# EAGLE design balise émettrice analogique (EAGLE 6.3)
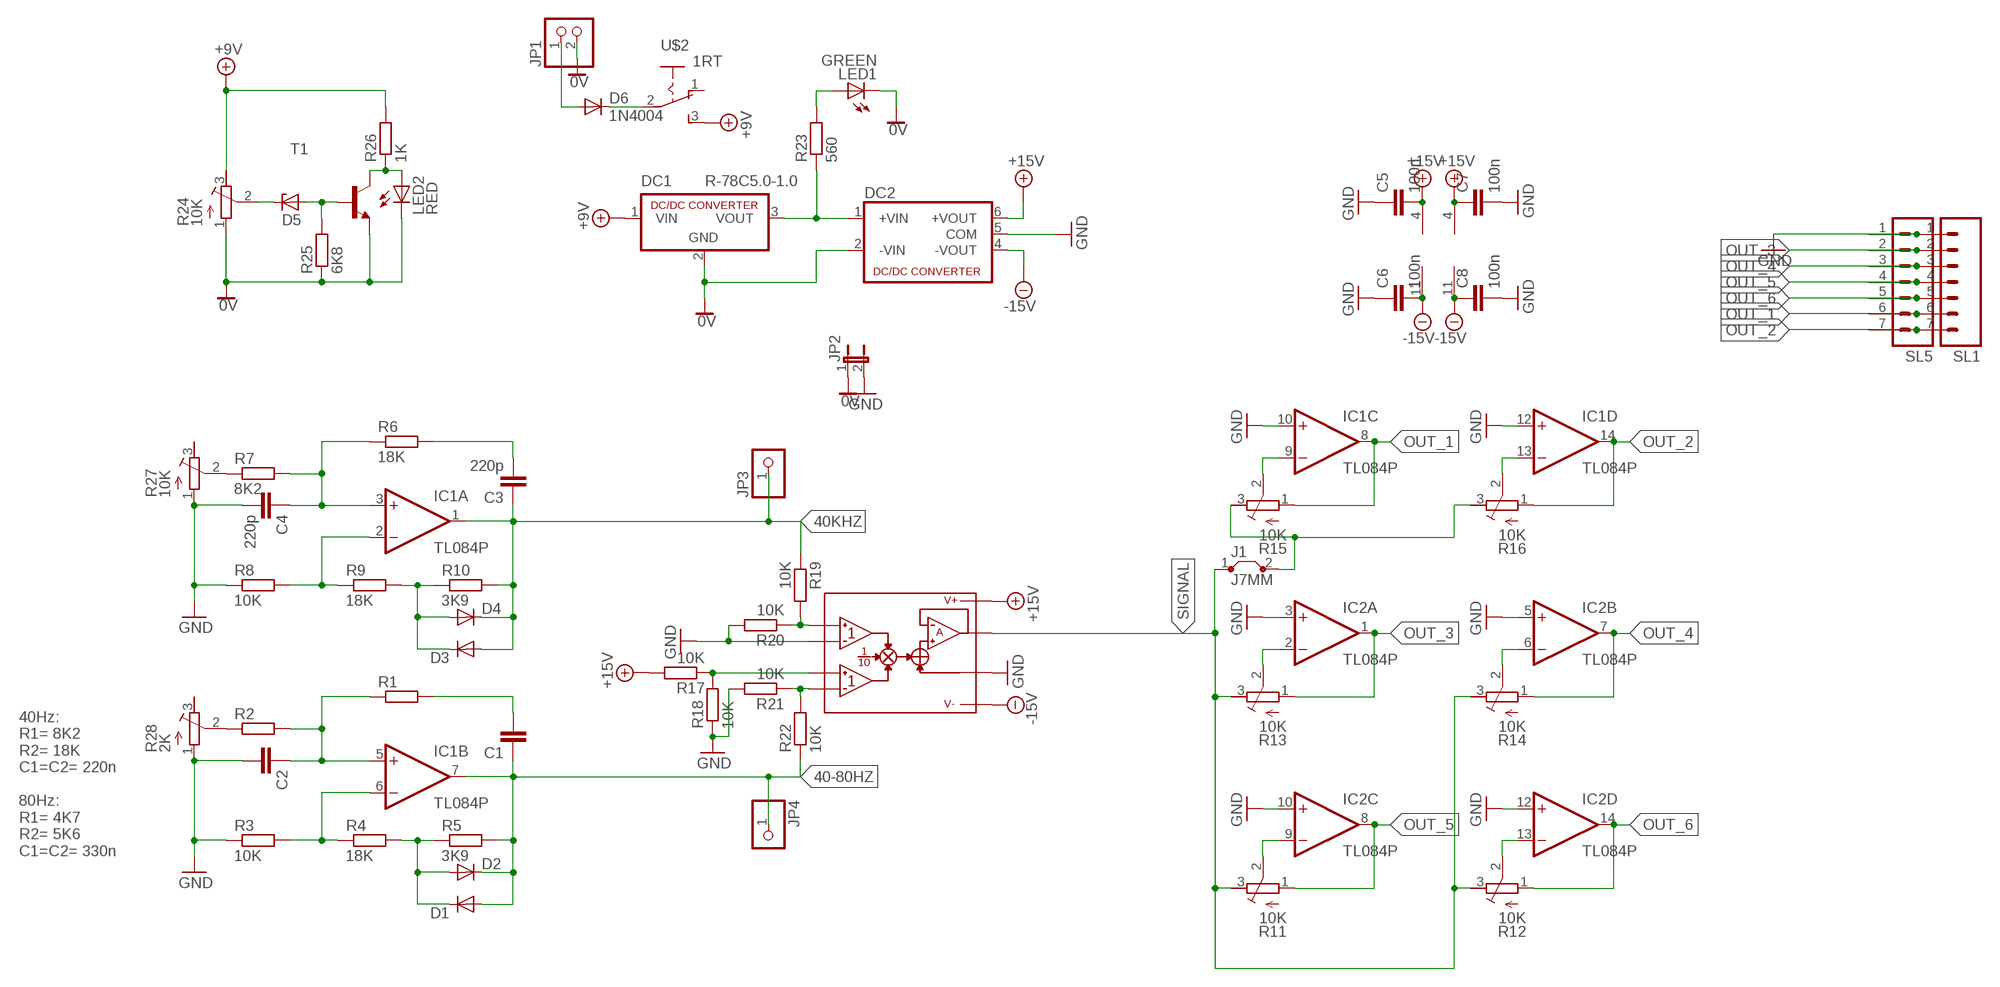
[diagram p0: schematic, sheet 1]

## Parts
C1  C-EU075-032X103  [C075-032X103]
C2  C-EU075-032X103  [C075-032X103]
C3  220p  C-EU075-032X103  [C075-032X103]
C4  220p  C-EU075-032X103  [C075-032X103]
C5  100n  C-EU050-024X044  [C050-024X044]
C6  100n  C-EU050-024X044  [C050-024X044]
C7  100n  C-EU050-024X044  [C050-024X044]
C8  100n  C-EU050-024X044  [C050-024X044]
D1  DIODE-D-2.5  [D-2.5]
D2  DIODE-D-2.5  [D-2.5]
D3  DIODE-D-2.5  [D-2.5]
D4  DIODE-D-2.5  [D-2.5]
D5  ZENER-DIODEZD-2.5  [ZDIO-2.5]
D6  1N4004  [DO41-10]
DC1  R-78C5.0-1.0  [SIP3]
DC2  NMA  [NMA]
IC1  TL084P  [DIL14]
IC2  TL084P  [DIL14]
J1  J7MM  [07]
JP1  PINHD-1X2  [1X02]
JP2  JP1E  [JP1]
JP3  PINHD-1X1  [1X01]
JP4  PINHD-1X1  [1X01]
LED1  GREEN  LEDB155  [Q62902-B155]
LED2  RED  LEDB155  [Q62902-B155]
R1  R-EU_0207/2V  [0207/2V]
R2  R-EU_0204/7  [0204/7]
R3  10K  R-EU_0207/2V  [0207/2V]
R4  18K  R-EU_0207/2V  [0207/2V]
R5  3K9  R-EU_0207/2V  [0207/2V]
R6  18K  R-EU_0207/2V  [0207/2V]
R7  8K2  R-EU_0207/2V  [0207/2V]
R8  10K  R-EU_0207/2V  [0207/2V]
R9  18K  R-EU_0207/2V  [0207/2V]
R10  3K9  R-EU_0207/2V  [0207/2V]
R11  10K  R-TRIMM3339P  [RTRIM3339P]
R12  10K  R-TRIMM3339P  [RTRIM3339P]
R13  10K  R-TRIMM3339P  [RTRIM3339P]
R14  10K  R-TRIMM3339P  [RTRIM3339P]
R15  10K  R-TRIMM3339P  [RTRIM3339P]
R16  10K  R-TRIMM3339P  [RTRIM3339P]
R17  10K  R-EU_0207/2V  [0207/2V]
R18  10K  R-EU_0207/2V  [0207/2V]
R19  10K  R-EU_0207/2V  [0207/2V]
R20  10K  R-EU_0207/2V  [0207/2V]
R21  10K  R-EU_0207/2V  [0207/2V]
R22  10K  R-EU_0207/2V  [0207/2V]
R23  560  R-EU_0204/7  [0204/7]
R24  10K  R-TRIMM3339P  [RTRIM3339P]
R25  6K8  R-EU_0207/2V  [0207/2V]
R26  1K  R-EU_0207/2V  [0207/2V]
R27  10K  R-TRIMM3339P  [RTRIM3339P]
R28  2K  R-TRIMM3339P  [RTRIM3339P]
SL1  M07  [07P]
SL5  M07  [07P]
T1  2N5400-NPN-TO92-CBE  [TO92-CBE]
U$1  AD633JN  [DIL08]
U$2  1RT  [1RT]

## Nets
0V: DC1.2(GND) DC2.2(-VIN) JP1.2 JP2.1 LED1.K(C) LED2.K(C) R24.1(E) R25.1 T1.E
40-80HZ: C1.1 D1.A D2.C IC1.7(B:OUT) JP4.1 R5.2 R22.1
40KHZ: C3.1 D3.A D4.C IC1.1(A:OUT) JP3.1 R10.2 R19.1
+9V: DC1.1(VIN) R24.3(A) R26.2 U$2.3(S)
+15V: C5.2 C7.1 DC2.6(+VOUT) IC1.4(P:V+) IC2.4(P:V+) R17.2 U$1.8(+V)
-15V: C6.2 C8.1 DC2.4(-VOUT) IC1.11(P:V-) IC2.11(P:V-) U$1.5(-V)
GND: C2.2 C4.2 C5.1 C6.1 C7.2 C8.2 DC2.5(COM) IC1.10(C:+IN) IC1.12(D:+IN) IC2.3(A:+IN) IC2.5(B:+IN) IC2.10(C:+IN) IC2.12(D:+IN) JP2.2 R3.1 R8.1 R18.1 R20.2 R21.2 R27.1(E) R28.1(E) SL1.1 SL5.1 U$1.2(X2) U$1.6(Z)
N$1: IC1.6(B:-IN) R3.2 R4.1
N$2: D1.C D2.A R4.2 R5.1
N$3: IC2.9(C:-IN) R11.2(S)
N$4: C1.2 R1.2
N$5: C2.1 IC1.5(B:+IN) R1.1 R2.2
N$6: IC1.2(A:-IN) R8.2 R9.1
N$7: D3.C D4.A R9.2 R10.1
N$8: R17.1 R18.2 U$1.3(Y1)
N$9: C3.2 R6.2
N$10: C4.1 IC1.3(A:+IN) R6.1 R7.2
N$11: DC1.3(VOUT) DC2.1(+VIN) R23.1
N$12: IC2.13(D:-IN) R12.2(S)
N$13: R19.2 R20.1 U$1.1(X1)
N$14: LED1.A R23.2
N$15: IC2.2(A:-IN) R13.2(S)
N$16: R21.1 R22.2 U$1.4(Y2)
N$17: D5.C R24.2(S)
N$18: IC2.6(B:-IN) R14.2(S)
N$19: D5.A R25.2 T1.B
N$20: D6.A JP1.1
N$21: IC1.9(C:-IN) R15.2(S)
N$22: LED2.A R26.1 T1.C
N$23: D6.C U$2.2(P)
N$24: IC1.13(D:-IN) R16.2(S)
N$25: J1.2 R15.3(A) R16.3(A)
N$26: R7.1 R27.2(S)
N$27: R2.1 R28.2(S)
OUT_1: IC1.8(C:OUT) R15.1(E) SL1.6 SL5.6
OUT_2: IC1.14(D:OUT) R16.1(E) SL1.7 SL5.7
OUT_3: IC2.1(A:OUT) R13.1(E) SL1.2 SL5.2
OUT_4: IC2.7(B:OUT) R14.1(E) SL1.3 SL5.3
OUT_5: IC2.8(C:OUT) R11.1(E) SL1.4 SL5.4
OUT_6: IC2.14(D:OUT) R12.1(E) SL1.5 SL5.5
SIGNAL: J1.1 R11.3(A) R12.3(A) R13.3(A) R14.3(A) U$1.7(W)
Unconnected: R27.3(A) R28.3(A) U$2.1(O)

## Notes on the sheet
- 40Hz:
  R1= 8K2
  R2= 18K
  C1=C2= 220n
  
  80Hz:
  R1= 4K7
  R2= 5K6
  C1=C2= 330n

## Library data of the parts
C1 C2 C5-C8 = resistor:C-EU: CAPACITOR, European symbol; OC_FARNELL: unknown
C3 C4 = resistor:C-EU: CAPACITOR, European symbol; MF: PANASONIC ELECTRONIC COMPONENTS; MPN: EEE1EA220SP; OC_FARNELL: 9696970
D1-D4 = diode:DIODE-: DIODE; OC_FARNELL: unknown
D5 = diode:ZENER-DIODE: Z-Diode; OC_FARNELL: unknown
D6 = diode:1N4004: DIODE general purpose rectifier, 1 A; OC_FARNELL: unknown
DC1 = dc-dc-converter:R-78C*-1.0: INNOLINE DC/DC-Converter 1.0 AMP SIP3 Single Output Source: Data sheet <http://www.mikrocontroller.net/attachment/150645/157764-da-01-en-DC_DC_WANDLER_R_78C5_0_1_0.pdf>; OC_FARNELL: unknown
DC2 = dc-dc-converter:NMA: DC-DC CONVERTER; MF: MURATA POWER SOLUTIONS; MPN: NMA1205DC; OC_FARNELL: 1021434; OC_NEWARK: 61K3064
IC1 IC2 = linear:TL084: OP AMP; OC_FARNELL: unknown
J1 = jumper:J: Bridge; OC_FARNELL: unknown
JP1 = pinhead:PINHD-1X2: PIN HEADER; OC_FARNELL: unknown
JP2 = jumper:JP1E: JUMPER; OC_FARNELL: unknown
JP3 JP4 = pinhead:PINHD-1X1: PIN HEADER; OC_FARNELL: unknown
LED1 LED2 = led:LED: LED OSRAM: - CHIPLED LG R971, LG N971, LY N971, LG Q971, LY Q971, LO R971, LY R971 LH N974, LH R974 LS Q976, LO Q976, LY Q976 LO Q996 - Hyper CHIPLED LW Q18S LB Q993, LB Q99A, LB R99A - SideLED LS A670, LO A670, LY A670, LG A670, LP A670 LB A673, LV A673, LT A673, LW A673 LH A674 LY A675 LS A676, LA A676, LO A676, LY A676, LW A676 LS A679, LY A679, LG A679 - Hyper Micro SIDELED® LS Y876, LA Y876, LO Y876, LY Y876 LT Y87S - SmartLED LW L88C, LW L88S LB L89C, LB L89S, LG L890 LS L89K, LO L89K, LY L89K LS L896, LA L896, LO L896, LY L896 - TOPLED LS T670, LO T670, LY T670, LG T670, LP T670 LSG T670, LSP T670, LSY T670, LOP T670, LYG T670 LG T671, LOG T671, LSG T671 LB T673, LV T673, LT T673, LW T673 LH T674 LS T676, LA T676, LO T676, LY T676, LB T676, LH T676, LSB T676, LW T676 LB T67C, LV T67C, LT T67C, LS T67K, LO T67K, LY T67K, LW E67C LS E67B, LA E67B, LO E67B, LY E67B, LB E67C, LV E67C, LT E67C LW T67C LS T679, LY T679, LG T679 LS T770, LO T770, LY T770, LG T770, LP T770 LB T773, LV T773, LT T773, LW T773 LH T774 LS E675, LA E675, LY E675, LS T675 LS T776, LA T776, LO T776, LY T776, LB T776 LHGB T686 LT T68C, LB T68C - Hyper Mini TOPLED® LB M676 - Mini TOPLED Santana® LG M470 LS M47K, LO M47K, LY M47K Source: http://www.osram.convergy.de LUXEON: - LUMILED® LXK2-PW12-R00, LXK2-PW12-S00, LXK2-PW14-U00, LXK2-PW14-V00 LXK2-PM12-R00, LXK2-PM12-S00, LXK2-PM14-U00 LXK2-PE12-Q00, LXK2-PE12-R00, LXK2-PE12-S00, LXK2-PE14-T00, LXK2-PE14-U00 LXK2-PB12-K00, LXK2-PB12-L00, LXK2-PB12-M00, LXK2-PB14-N00, LXK2-PB14-P00, LXK2-PB14-Q00 LXK2-PR12-L00, LXK2-PR12-M00, LXK2-PR14-Q00, LXK2-PR14-R00 LXK2-PD12-Q00, LXK2-PD12-R00, LXK2-PD12-S00 LXK2-PH12-R00, LXK2-PH12-S00 LXK2-PL12-P00, LXK2-PL12-Q00, LXK2-PL12-R00 Source: www.luxeon.com KINGBRIGHT: KA-3528ASYC Source: www.kingbright.com; OC_FARNELL: unknown
R1-R10 R17-R23 R25 R26 = resistor:R-EU_: RESISTOR, European symbol; OC_FARNELL: unknown
R11-R16 R24 R27 R28 = resistor:R-TRIMM: Trimm resistor; OC_FARNELL: unknown
SL1 SL5 = con-amp-quick:M07: AMP QUICK CONNECTOR; OC_FARNELL: unknown; OC_NEWARK: unknown
T1 = transistor:*-NPN-: NPN Transistror BF959 corrected 2008.03.06; OC_FARNELL: unknown
U$1 = analog-devices:AD633JN; OC_FARNELL: unknown
U$2 = switch:1RT; OC_FARNELL: unknown

## Board
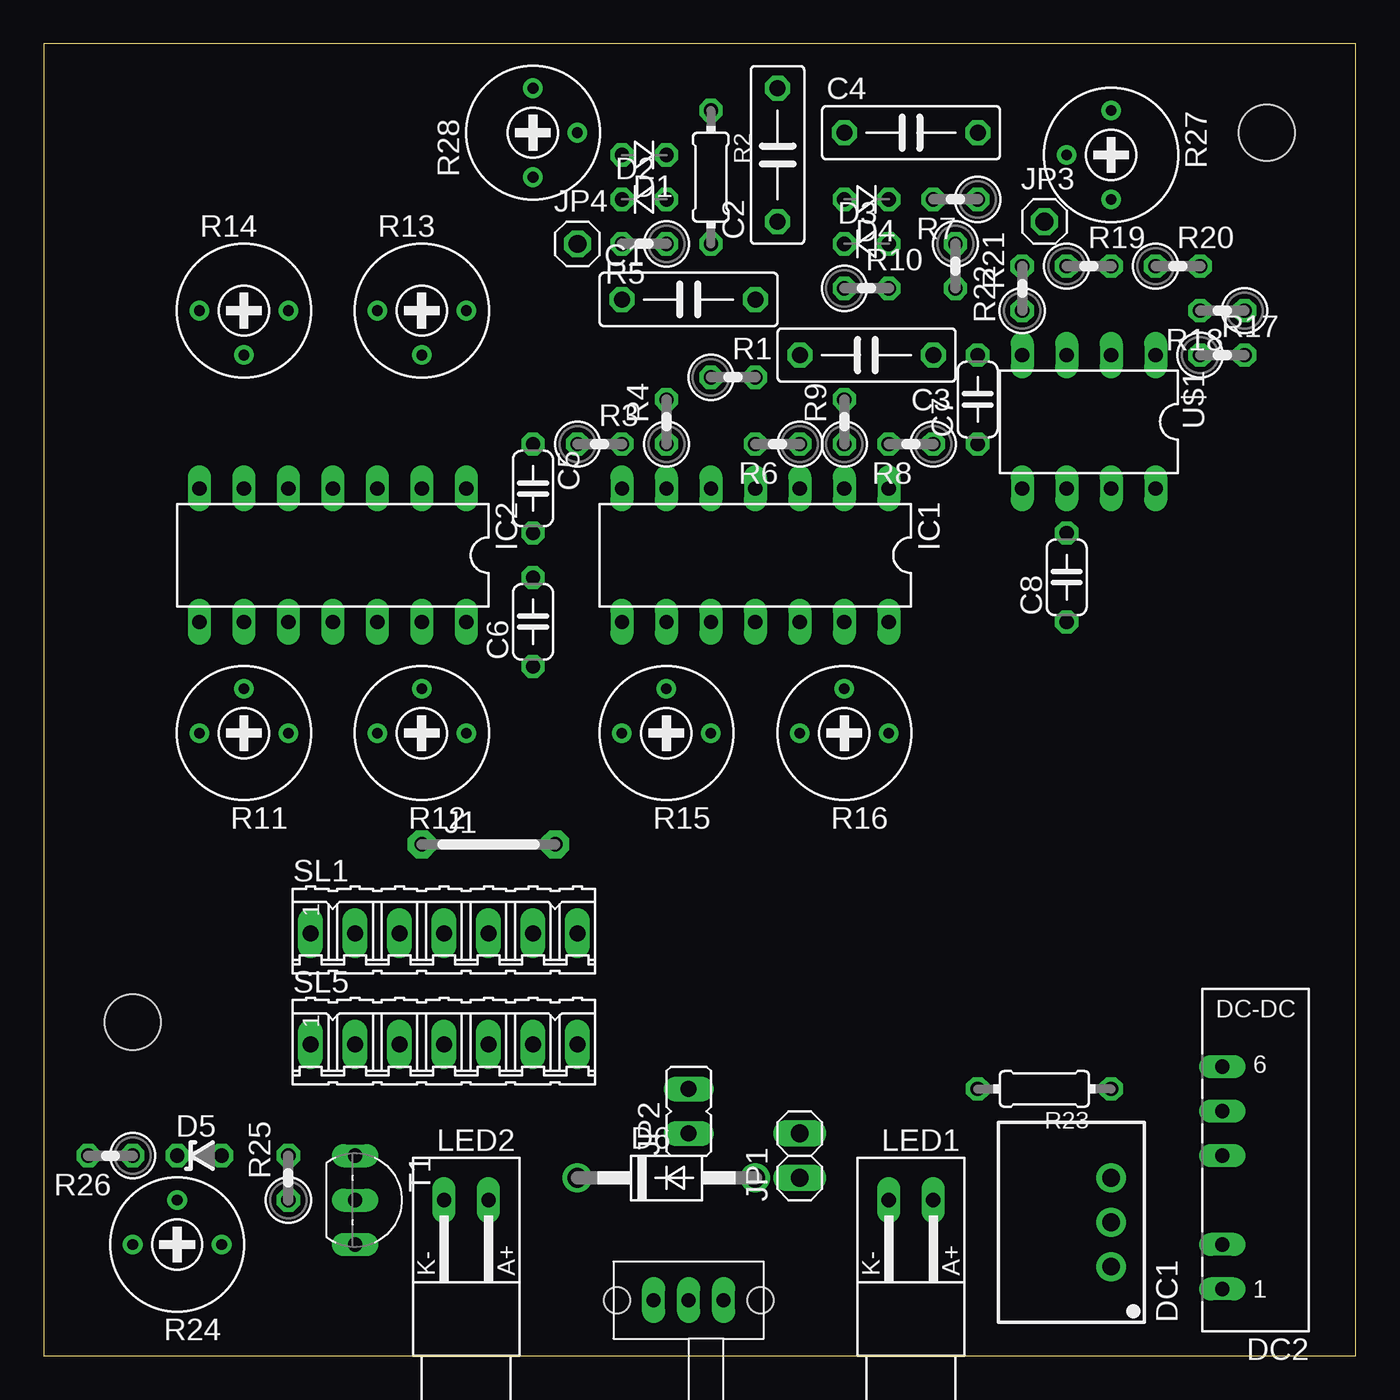
[diagram p1: board, top side]
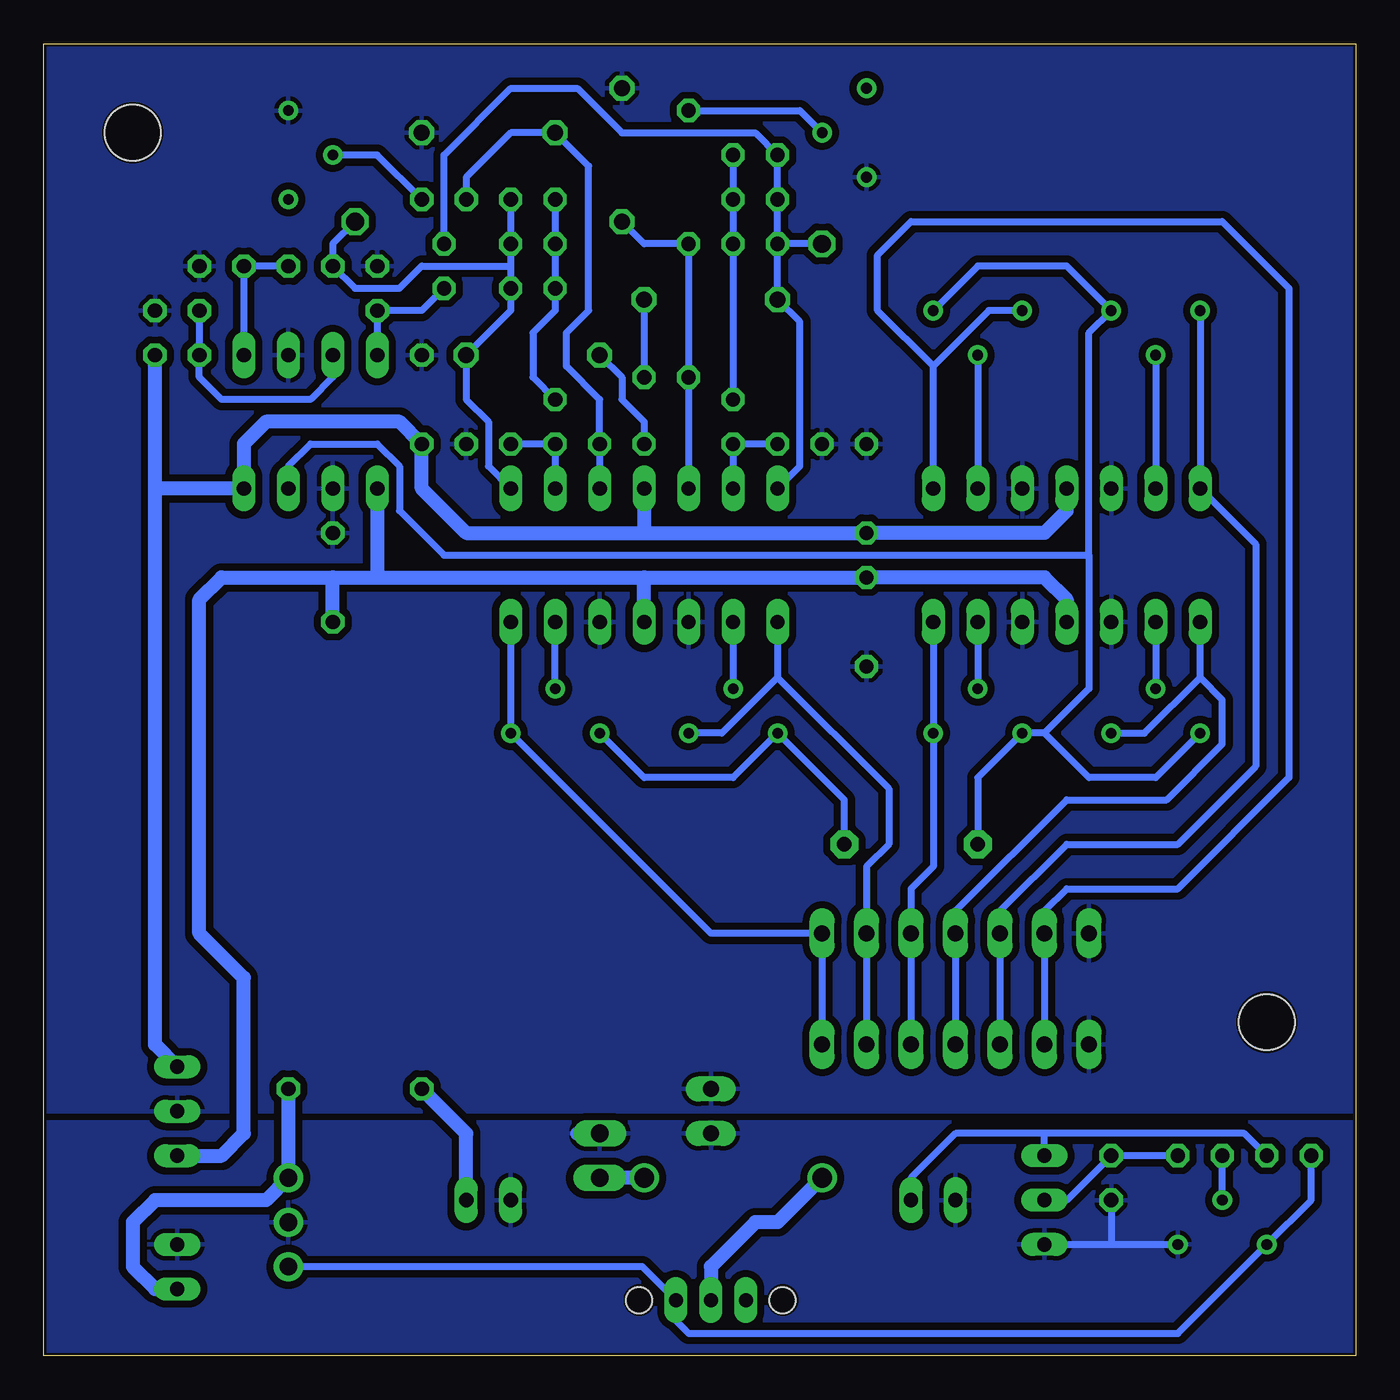
[diagram p2: board, bottom side, seen from below]

Size 74.93 x 74.93 mm. Coordinates in mm from the lower left corner, seen from the top.
Outline: 0,74.93 0,0 74.93,0 74.93,74.93 0,74.93
Copper layers (1*16): Top 0.035mm / dielectric 1.5mm / Bottom 0.035mm
Design rules "default *": minimum track width 6mil, minimum drill 18mil, track to track 16mil, track to pad 14mil, pad to pad 16mil, via to via 16mil, smd to smd 16mil, copper to edge 6mil, drill to drill 6mil, minimum pad ring 10mil, minimum via ring 8mil, stop-mask expansion 4mil, vias tented up to drill 0mil, thermal gap 10mil
Holes 3.2 mm at 69.85,69.85 5.08,19.05

### Footprints (pad centres in the part's own frame; a part is rotated, then mirrored left to right if it is on the bottom)
C075-032X103 = drill 0.914 octagon: 1 -3.81,0; 2 3.81,0
C050-024X044 = drill 0.813 octagon: 1 -2.54,0; 2 2.54,0
D-2.5 = drill 0.813 octagon: A 1.27,0; C -1.27,0
ZDIO-2.5 = drill 0.813 octagon: A 1.27,0; C -1.27,0
DO41-10 = drill 1.118: A 5.08,0; C -5.08,0
SIP3 = drill 1 pad 1.676: 1 -2.54,0; 2 0,0; 3 2.54,0
NMA = drill 0.813 long: 1 0,6.35; 2 0,3.81; 4 0,-1.27; 5 0,-3.81; 6 0,-6.35
DIL14 = drill 0.813 long: 1 -7.62,-3.81; 2 -5.08,-3.81; 3 -2.54,-3.81; 4 0,-3.81; 5 2.54,-3.81; 6 5.08,-3.81; 7 7.62,-3.81; 8 7.62,3.81; 9 5.08,3.81; 10 2.54,3.81; 11 0,3.81; 12 -2.54,3.81; 13 -5.08,3.81; 14 -7.62,3.81
07 = drill 0.813 pad 1.6 octagon: 1 -3.81,0; 2 3.81,0
1X02 = drill 1.016 long: 1 -1.27,0; 2 1.27,0
JP1 = drill 0.914 long: 1 0,-1.27; 2 0,1.27
1X01 = drill 1.016 octagon: 1 0,0
Q62902-B155 = drill 0.813 long: A 7.62,-1.27; K 7.62,1.27
0207/2V = drill 0.813 octagon: 1 -1.27,0; 2 1.27,0
0204/7 = drill 0.813 octagon: 1 -3.81,0; 2 3.81,0
RTRIM3339P = drill 0.61: 1 -2.54,0; 2 0,-2.54; 3 2.54,0
07P = drill 0.914 long: 1 -7.62,0; 2 -5.08,0; 3 -2.54,0; 4 0,0; 5 2.54,0; 6 5.08,0; 7 7.62,0
TO92-CBE = drill 0.813 long: B 0,0; C -2.54,0; E 2.54,0
DIL08 = drill 0.813 long: 1 -3.81,-3.81; 2 -1.27,-3.81; 3 1.27,-3.81; 4 3.81,-3.81; 5 3.81,3.81; 6 1.27,3.81; 7 -1.27,3.81; 8 -3.81,3.81
1RT = drill 0.8 long: 1 -2,0; 2 0,0; 3 2,0 | hole 1.5: 4.1,0; -4.1,0

### Placement (x,y rotation side)
C1  36.83,60.33 0 top
C2  41.91,68.58 90 top
C3  46.99,57.15 180 top
C4  49.53,69.85 0 top
C5  27.94,49.53 270 top
C6  27.94,41.91 90 top
C7  53.34,54.61 90 top
C8  58.42,44.45 90 top
D1  34.29,68.58 180 top
D2  34.29,66.04 0 top
D3  46.99,63.5 0 top
D4  46.99,66.04 180 top
D5  8.89,11.43 0 top
D6  35.56,10.16 0 top
DC1  60.96,7.62 90 top
DC2  67.31,10.16 180 top
IC1  40.64,45.72 180 top
IC2  16.51,45.72 180 top
J1  25.4,29.21 0 top
JP1  43.18,11.43 90 top
JP2  36.83,13.97 0 top
JP3  57.15,64.77 0 top
JP4  30.48,63.5 0 top
LED1  49.53,1.27 90 top
LED2  24.13,1.27 90 top
R1  39.37,55.88 0 top
R2  38.1,67.31 270 top
R3  31.75,52.07 0 top
R4  35.56,53.34 90 top
R5  34.29,63.5 180 top
R6  41.91,52.07 180 top
R7  52.07,66.04 180 top
R8  49.53,52.07 180 top
R9  45.72,53.34 90 top
R10  46.99,60.96 0 top
R11  11.43,35.56 180 top
R12  21.59,35.56 180 top
R13  21.59,59.69 0 top
R14  11.43,59.69 0 top
R15  35.56,35.56 180 top
R16  45.72,35.56 180 top
R17  67.31,57.15 0 top
R18  67.31,59.69 180 top
R19  59.69,62.23 0 top
R20  64.77,62.23 0 top
R21  55.88,60.96 90 top
R22  52.07,62.23 270 top
R23  57.15,15.24 180 top
R24  7.62,6.35 180 top
R25  13.97,10.16 90 top
R26  3.81,11.43 180 top
R27  60.96,68.58 270 top
R28  27.94,69.85 90 top
SL1  22.86,24.13 0 top
SL5  22.86,17.78 0 top
T1  17.78,8.89 270 top
U$1  59.69,53.34 180 top
U$2  36.83,3.17 0 top

### Tracks (layer width: path | path; a pad name or v marks a point on that pad's centre or on a via)
0V
  Bottom 0.406: T1.E 13.97,6.35 | 13.97,6.35 R24.1 | R25.1 13.97,6.35
  Bottom 0.813: JP1.2 44.45,12.7
  pour Bottom: 0,13.34 74.93,13.34 74.93,0 0,0
40-80HZ
  Bottom 0.406: IC1.7 31.75,50.8 31.75,59.05 C1.1 R5.2 | R5.2 D2.C D1.A 34.29,69.85 41.91,69.85 44.45,72.39 48.26,72.39 52.07,68.58 R22.1 | JP4.1 R5.2
40KHZ
  Bottom 0.406: D4.C D3.A 48.26,62.23 | 48.26,62.23 R10.2 48.26,59.69 C3.1 50.8,54.61 49.53,53.34 49.53,50.8 IC1.1 | 48.26,62.23 53.34,62.23 54.61,60.96 57.15,60.96 R19.1 58.42,63.5 JP3.1
+9V
  Bottom 0.406: R26.2 2.54,8.89 R24.3 10.16,1.27 38.1,1.27 38.83,2 U$2.3 40.73,5.08 DC1.1
+15V
  Bottom 0.813: 63.5,50.8 U$1.8 | 40.64,46.99 50.8,46.99 53.34,49.53 C7.1 54.61,53.34 62.23,53.34 63.5,52.07 U$1.8 | 40.64,46.99 C5.2 17.78,46.99 16.51,48.26 IC2.4 | IC1.4 40.64,46.99 | DC2.6 68.58,17.78 68.58,49.53 | 68.58,49.53 R17.2 | U$1.8 68.58,49.53
-15V
  Bottom 0.813: 58.42,44.45 64.77,44.45 66.04,43.18 66.04,24.13 63.5,21.59 63.5,12.7 64.77,11.43 DC2.4 | 58.42,44.45 55.88,44.45 | U$1.5 55.88,44.45 | C8.1 58.42,44.45 | 55.88,44.45 40.64,44.45 | 40.64,44.45 C6.2 17.78,44.45 16.51,43.18 IC2.11 | IC1.11 40.64,44.45
GND
  pour Bottom: 0,74.93 74.93,74.93 74.93,13.97 0,13.97
N$1
  Bottom 0.406: R3.2 R4.1 IC1.6
N$2
  Bottom 0.406: D1.C D2.A R5.1 R4.2
N$3
  Bottom 0.406: IC2.9 R11.2
N$4
  Bottom 0.406: C1.2 R1.2
N$5
  Bottom 0.406: C2.1 40.64,63.5 R2.2 R1.1 IC1.5
N$6
  Bottom 0.406: IC1.2 R9.1 R8.2
N$7
  Bottom 0.406: D4.A D3.C R10.1 45.72,59.69 46.99,58.42 46.99,55.88 R9.2
N$8
  Bottom 0.406: R18.2 R17.1 66.04,55.88 64.77,54.61 59.69,54.61 58.42,55.88 U$1.3
N$9
  Bottom 0.406: C3.2 41.91,55.88 41.91,54.61 40.64,53.34 R6.2
N$10
  Bottom 0.406: IC1.3 R6.1 43.18,54.61 45.09,56.52 45.09,58.42 43.81,59.69 43.81,67.94 C4.1 48.26,69.85 50.8,67.31 R7.2
N$11
  Bottom 0.813: R23.1 DC1.3 62.23,8.89 68.58,8.89 69.85,7.62 69.85,5.08 68.58,3.81 DC2.1
N$12
  Bottom 0.406: IC2.13 R12.2
N$13
  Bottom 0.406: R19.2 R20.1 U$1.1
N$14
  Bottom 0.813: LED1.A 50.8,12.7 R23.2
N$15
  Bottom 0.406: R13.2 IC2.2
N$16
  Bottom 0.406: R22.2 53.34,59.69 R21.1 U$1.4
N$17
  Bottom 0.406: R24.2 D5.C
N$18
  Bottom 0.406: R14.2 IC2.6
N$19
  Bottom 0.406: D5.A R25.2 16.51,8.89 T1.B
N$20
  Bottom 0.813: D6.A JP1.1
N$21
  Bottom 0.406: IC1.9 R15.2
N$22
  Bottom 0.406: R26.1 6.35,12.7 17.78,12.7 | LED2.A 25.4,10.16 22.86,12.7 17.78,12.7 | T1.C 17.78,12.7
N$23
  Bottom 0.813: D6.C 33.02,7.62 34.29,7.62 36.83,5.08 U$2.2
N$24
  Bottom 0.406: R16.2 IC1.13
N$25
  Bottom 0.406: R16.3 40.64,33.02 35.56,33.02 R15.3 29.21,31.75 J1.2
N$26
  Bottom 0.406: R7.1 55.88,68.58 R27.2
N$27
  Bottom 0.406: R2.1 31.75,71.12 R28.2
OUT_1
  Bottom 0.406: IC1.8 33.02,38.73 | 33.02,38.73 36.2,35.56 R15.1 | 33.02,38.73 26.67,32.38 26.67,29.21 27.94,27.94 SL1.6 SL5.6
OUT_2
  Bottom 0.406: IC1.14 R16.1 36.83,24.13 SL1.7 SL5.7
OUT_3
  Bottom 0.406: R13.1 20.95,59.69 24.13,56.52 | IC2.1 24.13,56.52 | 24.13,56.52 27.3,59.69 27.3,62.87 25.4,64.77 7.62,64.77 3.81,60.96 3.81,33.02 10.16,26.67 16.51,26.67 17.78,25.4 SL1.2 SL5.2
OUT_4
  Bottom 0.406: R14.1 IC2.7 5.71,46.35 5.71,33.66 10.16,29.21 16.51,29.21 20.32,25.4 SL1.3 SL5.3
OUT_5
  Bottom 0.406: 8.89,38.73 IC2.8 | R11.1 12.06,35.56 8.89,38.73 | 8.89,38.73 7.62,37.47 7.62,34.92 10.79,31.75 16.51,31.75 22.86,25.4 SL1.4 SL5.4
OUT_6
  Bottom 0.406: IC2.14 R12.1 24.13,27.94 25.4,26.67 SL1.5 SL5.5
SIGNAL
  Bottom 0.406: U$1.7 60.96,50.8 59.69,52.07 55.88,52.07 54.61,50.8 54.61,48.26 52.07,45.72 15.24,45.72 | 15.24,45.72 15.24,58.42 R14.3 16.51,62.23 21.59,62.23 R13.3 | 15.24,45.72 15.24,38.1 17.78,35.56 | 17.78,35.56 R12.3 21.59,33.02 J1.1 | R11.3 11.43,33.02 15.24,33.02 17.78,35.56